# Altium schematic sheet LED-Chaser.SchDoc
size A; SheetNumber: 1; SheetTotal: 1
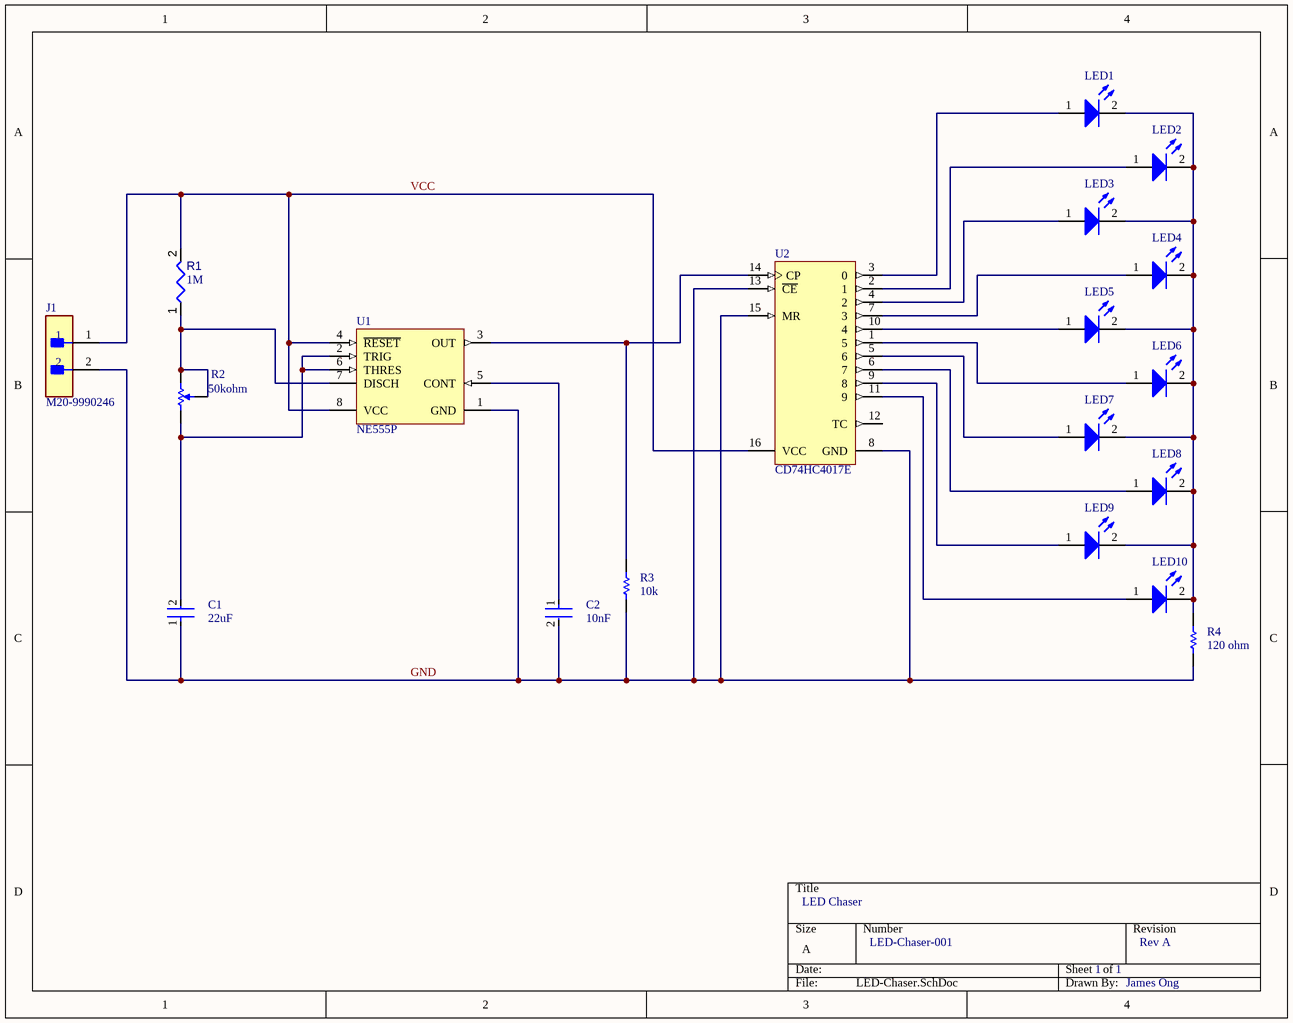
[diagram p0: LED-Chaser.SchDoc]

## Parts
C1  Capacitance: 22uF  [FP-RCEWM1-MFG]  (hidden comment: RCER71E226MWM1H03A)
C2  Capacitance: 10nF  [FP-RCE0K1-MFG]  (hidden comment: RCER71H103K0K1H03B)
J1  M20-9990246  [FP-M20-9990246-MFG]
LED1  151051BS04000  [WL-TMRC_D5.9H8.7]  (value not drawn)
LED2  151051BS04000  [WL-TMRC_D5.9H8.7]  (value not drawn)
LED3  151051BS04000  [WL-TMRC_D5.9H8.7]  (value not drawn)
LED4  151051BS04000  [WL-TMRC_D5.9H8.7]  (value not drawn)
LED5  151051BS04000  [WL-TMRC_D5.9H8.7]  (value not drawn)
LED6  151051BS04000  [WL-TMRC_D5.9H8.7]  (value not drawn)
LED7  151051BS04000  [WL-TMRC_D5.9H8.7]  (value not drawn)
LED8  151051BS04000  [WL-TMRC_D5.9H8.7]  (value not drawn)
LED9  151051BS04000  [WL-TMRC_D5.9H8.7]  (value not drawn)
LED10  151051BS04000  [WL-TMRC_D5.9H8.7]  (value not drawn)
R1  value 1M  [RESA60-630X240]  (hidden comment: MFR-25FBF52-1M)
R2  Track Resistance: 50kohm  [BOUR-3313J-1_V]  (hidden comment: 3313J-1-503E)
R3  Resistance (Ohms): 10k  [OMTE-RES7X2.5-2]  (hidden comment: OD103JE)
R4  Resistance (Ohms): 120 ohm  [OMTE-RES7X2.5-2]  (hidden comment: OD103JE)
U1  NE555P  [P0008A]
U2  CD74HC4017E  [N0016A]

## Nets
GND: C1.1 C2.2 J1.2 R3.1 R4.1 U1.1(GND) U2.8(GND) U2.13(~{CE}) U2.15(MR)
VCC: J1.1 R1.2 U1.4(~{RESET}) U1.8(VCC) U2.16(VCC)
NetC1_2: C1.2 R2.1 U1.2(TRIG) U1.6(THRES)
NetC2_1: C2.1 U1.5(CONT)
NetLED1_1: LED1.1(A) U2.3(0)
NetLED1_2: LED1.2(K) LED2.2(K) LED3.2(K) LED4.2(K) LED5.2(K) LED6.2(K) LED7.2(K) LED8.2(K) LED9.2(K) LED10.2(K) R4.2
NetLED2_1: LED2.1(A) U2.2(1)
NetLED3_1: LED3.1(A) U2.4(2)
NetLED4_1: LED4.1(A) U2.7(3)
NetLED5_1: LED5.1(A) U2.10(4)
NetLED6_1: LED6.1(A) U2.1(5)
NetLED7_1: LED7.1(A) U2.5(6)
NetLED8_1: LED8.1(A) U2.6(7)
NetLED9_1: LED9.1(A) U2.9(8)
NetLED10_1: LED10.1(A) U2.11(9)
NetR1_1: R1.1 R2.2 R2.3 U1.7(DISCH)
NetR3_2: R3.2 U1.3(OUT) U2.14(CP)

Not connected (* = marked no-connect by the designer): U2 12(TC)

## Notes on the sheet
- LED Chaser
- LED-Chaser-001
- 1
- Rev A
- James Ong

## Library data of the parts
C1 = CMP-06035-003622-1: CAP CER 22UF 25V X7R RADIAL; Tolerance: 20%; Lead Diameter: 0.5mm; Lead/Base Style: Formed Leads; Height - Seated (Max): 0.295inch; Height: 7.5mm; Max Operating Temperature: 125°C; Package Quantity: 1500; Case/Package: Radial; Length: 0.217inch; Lead Pitch: 0.197inch; Voltage Rating (DC): 25V; Ratings: AEC-Q200; Mount: Through Hole; Packaging: Tape and Reel; Voltage Rating: 25V; Min Operating Temperature: -55°C; Width: 0.157inch; Resistor Type: Ceramic; Termination: Radial; Dielectric: X7R
C2 = CMP-06035-044411-1: Cap Ceramic 10nF 50V X7R ±10% Radial 5mm +125°C Automotive Bulk; Lead/Base Style: Formed Leads; Lead Diameter: 0.5mm; Resistor Type: Ceramic; Mount: Through Hole; Lead Pitch: 0.197inch; Package Quantity: 500; Dielectric: X7R; Lead Free: Lead Free; Min Operating Temperature: -55°C; Packaging: Bulk; Width: 0.098inch; Length: 0.142inch; Voltage Rating: 50V; Case/Package: Radial; Max Operating Temperature: 125°C; Ratings: AEC-Q200; Height - Seated (Max): 0.138inch; Height: 3.5mm; Termination: Radial; Voltage Rating (DC): 50V; Tolerance: 10%
J1 = CMP-15831-000009-1: CONN HEADER VERT 2POS 2.54MM; Manufacturer: Harwin; Conn Gender: Male; Conn Orientation: Vertical; Number Of Contacts: 2; Current Rating: 3A; ComponentLink2URL: https://cdn.harwin.com/pdfs/M20-999.pdf; ComponentLink2Description: Datasheet; Package: M20-9990246; Temperature: -40°C to +105°C; Octopart: https://octopart.com/m20-9990246-harwin-2590635; Mouser Description: 2.54mm (0.1") Pitch SIL Vertical PC Tail Pin Header, 6.1mm mating pin height, tin, 2 contacts; Temperature Range High: +105°C; Device Class L1: Connectors; RoHS: TRUE; Automotive: No; Height: 8.99mm; Number Of Rows: 1; Contact Material: Tin,Nickel; Category: Conn; Pitch: 2.54mm; Lead Free: Yes; Digikey Description: CONN HEADER VERT 2POS 2.54MM; Manufacturer Part Number: M20-9990246; Temperature Range Low: -40°C; Device Class L3: unset; Device Class L2: Headers and Wire Housings
LED1-LED10 = CMP-1488-00009-2: NexarPartId: 29717812; Test Current: 20mA; Forward Voltage: 3.2V; Wavelength: 470nm; Lens Size: 5mm; Lens Style: Circular, Diffused, Round; Forward Current: 100mA; Peak Wavelength: 465nm; Viewing Angle: 40°; Luminous Intensity: 500mcd; Max Reverse Voltage (DC): 5V; Color: Blue; Case/Package: Radial; Width: 5mm; Mount: Through Hole; Min Operating Temperature: -40°C; Length: 5mm; Height: 8.6mm; Max Operating Temperature: 85°C; Packaging: Bulk; RoHS: Compliant; REACH SVHC: Unknown; Dominant Wavelength: 470nm
R1 = CMP-009-00049-4: Axial Resistor, 1 MOhm, +/- 1%, 250 mW, -55 to 155 degC, 2-Pin THD, RoHS, Bulk; Manufacturer: Yageo; Voltage Rating: 250V; Power: 250mW; Datasheet Version: Apr-13; Package Reference: MFR-25; Package Quantity: 200; Min Operating Temperature: -55°C; RoHS Compliant: True; Mounting Technology: TH; Datasheet URL: http://www.yageo.com/documents/recent/Yageo%20LR_MFR_2013.pdf; Max Operating Temperature: 155°C; Package Description: 2-Pin Axial Lead, Dia 2.4 mm, Body Length 6.3 mm; Packaging: Bulk; Tolerance: 1%; Case/Package: Axial; Manufacturer URL: http://www.yageo.com/
R2 = CMP-2000-05588-1: 3 mm Trimpot(R) Trimming Potentiometer, 50 KOhm, +/- 20%, 0.125 W, -55 to 125 degC, 3-Pin SMD, RoHS, Tape and Reel; Manufacturer: Bourns; SVHC: NoSVHC(19-Dec-2012); Temperature Coefficient: ±150ppm/°C; No. of Turns: 1; Power Rating: 125mW; Manufacturer URL: http://www.bourns.com/; Potentiometer Mounting: SMD; Package Description: 3-Pin Surface Mount Device, Body 3.5 x 3.2 mm, Pitch 1.15 mm; Package Reference: 3313J-1; Mounting Technology: SurfaceMount; Resistance Tolerance: ±20%; Datasheet Version: 05/2016; Datasheet URL: http://www.bourns.com/docs/Product-Datasheets/3313.pdf
R3 R4 = CMP-2000-06865-1: Little Demon(R) Carbon Composition Molded OD Series, 250 V, 10 KOhm, +/-5%, -70 to 130 degC, 2-Pin THD, RoHS, Bulk; Manufacturer: Ohmite; Power Rating: 0.25W; Power (Watts): 0.25W,1/4W; Tolerance: ±5%; Online Catalog: OD,OF,OASeries,LittleDemon®; Catalog Drawings: OD,OF,OASeries; EDA / CAD Models: DownloadfromAcceleratedDesigns; Mounting Technology: ThroughHole; Datasheet Version: 06/2016; RoHS Information: LittleDemon"E"SeriesMaterialDeclaration; Number of Terminations: 2; Temperature Coefficient: -; Height: -; Composition: CarbonComposition; Package Description: 2-Pin THD Resistor, Body 7 x 2.5 mm, Lead Dia. 0.6 mm; Size / Dimension: 0.098"Diax0.276"L(2.50mmx7.00mm); Category: Resistors; Manufacturer URL: http://www.ohmite.com/; Features: PulseWithstanding; Family: ThroughHoleResistors; PartNumber: OD103JE; Supplier Device Package: Axial; Package / Case: Axial; Standard Package: 100; Package Reference: RES7X2.5; Operating Temperature: -; Series: LittleDemon®OD; Datasheet URL: http://www.ohmite.com/cat/res_od_of_oa.pdf; Packaging: Bulk
U1 = CMP-2000-04954-1: Precision Timer, 4.5 to 16 V, 0 to 70 degC, 8-Pin DIP, Pb-Free, Tube; Manufacturer: TexasInstruments; Maximum High Level Output Current: -200mA; Number of Internal Timers: 1; Operating Supply Voltage: 5; Maximum Low Level Output Current: 200mA; Rad Hard: No; Packaging: Rail/Tube; Manufacturer URL: http://www.ti.com/; Package Reference: P8; Package Description: 8-Pin Double In-line Package, Body 9.59 x 6.35 mm, Pitch 2.54 mm; Package URL: http://www.ti.com/lit/ml/mpdi001b/mpdi001b.pdf; Type: Standard; Datasheet URL: http://www.ti.com/general/docs/lit/getliterature.tsp?genericPartNumber=NE555&fileType=pdf; Category: Timer; Package: 8PDIP; Datasheet Version: Rev. I, 09/2014
U2 = CMP-1623-00548-2: High Speed CMOS Logic Decade Counter/Divider with 10 Decoded Outputs, N0016A, TUBE; Manufacturer: Texas Instruments; tpd @ Nom Voltage(Max)(ns): 54; Inputs: 1; Input Type: LVTTL/CMOS; Voltage(Nom)(V): 3.3,5; Schmitt Trigger: No; Output Drive (IOL/IOH)(Max)(mA): 5.2/-5.2; Bits(#): 10; VCC(Max)(V): 6; Technology Family: HC; ICC @ Nom Voltage(Max)(mA): 0.08; Rating: Catalog; F @ Nom Voltage(Max)(Mhz): 28; VCC(Min)(V): 2; Generic Part Number: CD74HC4017; Code_JEDEC: MS-001; DatasheetVersion: SCHS200D; Output Type: CMOS; Type: Decade; Operating Temperature Range(C): -55 to 125; PackageReference: N0016A; Function: Counter